# EAGLE schematic HCTL200_module (EAGLE 6.6.0)
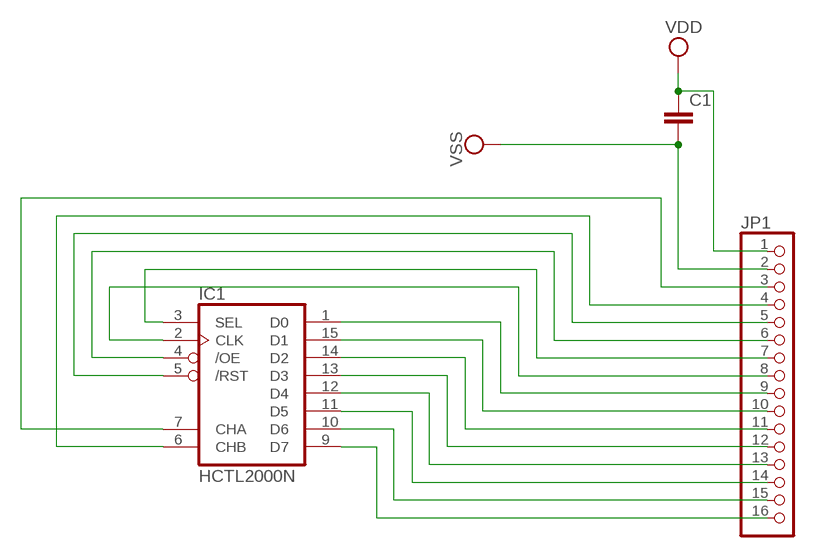
[diagram p0: schematic, sheet 1]

## Parts
C1  C-EU025-025X050  [C025-025X050]
IC1  HCTL2000N  [DIL16]
JP1  PINHD-1X16  [1X16]

## Nets
N$1: IC1.9(D7) JP1.16
N$2: IC1.10(D6) JP1.15
N$3: IC1.11(D5) JP1.14
N$4: IC1.12(D4) JP1.13
N$5: IC1.13(D3) JP1.12
N$6: IC1.14(D2) JP1.11
N$7: IC1.15(D1) JP1.10
N$8: IC1.1(D0) JP1.9
N$9: IC1.2(CLK) JP1.8
N$10: IC1.3(SEL) JP1.7
N$11: IC1.4(/OE) JP1.6
N$12: IC1.5(/RST) JP1.5
N$13: IC1.6(CHB) JP1.4
N$14: IC1.7(CHA) JP1.3
VDD: C1.1 JP1.1
VSS: C1.2 JP1.2

## Power pins joined to a net without a drawn wire
VDD: IC1.16(VDD)
VSS: IC1.8(VSS)

## Library data of the parts
C1 = rcl:C-EU: CAPACITOR, European symbol
IC1 = HCTL2000:HCTL2000: 4-bit parallel in/out SHIFT REGISTER
JP1 = pinhead:PINHD-1X16: PIN HEADER